# EAGLE design TDBR_MCP3221 (EAGLE 7.7.0)
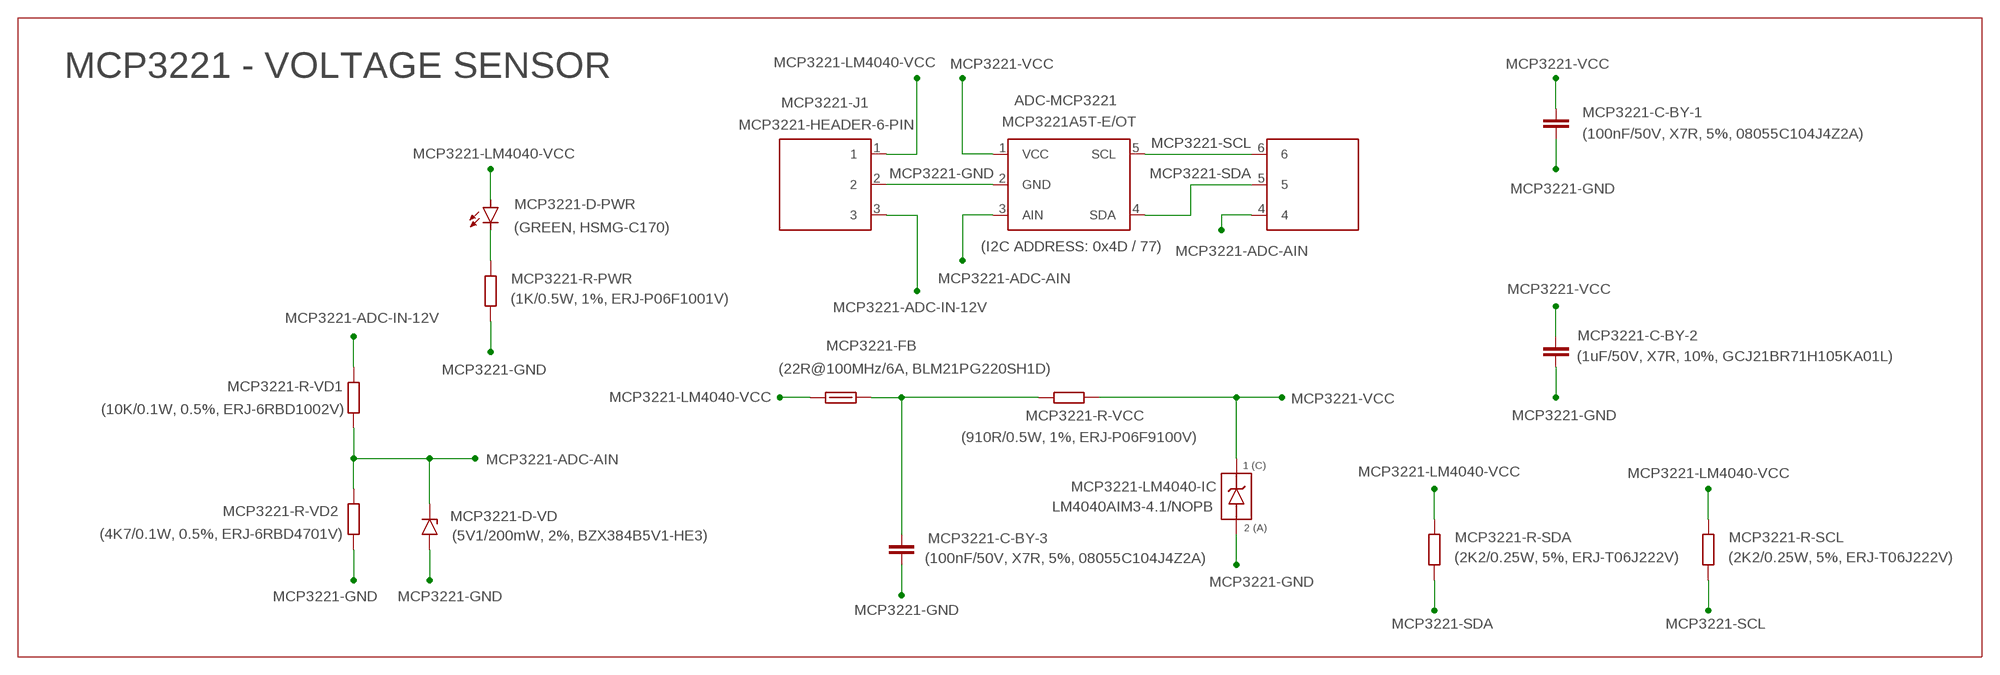
[diagram p0: schematic, sheet 1]

## Parts
ADC-MCP3221  MCP3221A5T-E/OT  [SOT-23-5]
MCP3221-C-BY-1  (100nF/50V, X7R, 5%, 08055C104J4Z2A)  08055C104J4Z2A  [0805]
MCP3221-C-BY-2  (1uF/50V, X7R, 10%, GCJ21BR71H105KA01L)  GCJ21BR71H105KA01L  [0805]
MCP3221-C-BY-3  (100nF/50V, X7R, 5%, 08055C104J4Z2A)  08055C104J4Z2A  [0805]
MCP3221-D-PWR  (GREEN, HSMG-C170)  HSMG-C170  [DIODE_0805]
MCP3221-D-VD  (5V1/200mW, 2%, BZX384B5V1-HE3)  BZX384B5V1-HE3  [SOD-323-DIODE]
MCP3221-FB  (22R@100MHz/6A, BLM21PG220SH1D)  BLM21PG220SH1D  [0805]
MCP3221-J1  MCP3221-HEADER-6-PIN  HEADER_6_PIN  [HEADER_2.54MM_6_PIN_VER]
MCP3221-LM4040-IC  LM4040AIM3-4.1/NOPB  [SOT-23-3]
MCP3221-R-PWR  (1K/0.5W, 1%, ERJ-P06F1001V)  ERJ-P06F1001V  [0805]
MCP3221-R-SCL  (2K2/0.25W, 5%, ERJ-T06J222V)  ERJ-T06J222V  [0805]
MCP3221-R-SDA  (2K2/0.25W, 5%, ERJ-T06J222V)  ERJ-T06J222V  [0805]
MCP3221-R-VCC  (910R/0.5W, 1%, ERJ-P06F9100V)  ERJ-P06F9100V  [0805]
MCP3221-R-VD1  (10K/0.1W, 0.5%, ERJ-6RBD1002V)  ERJ-6RBD1002V  [0805]
MCP3221-R-VD2  (4K7/0.1W, 0.5%, ERJ-6RBD4701V)  ERJ-6RBD4701V  [0805]

## Nets
MCP3221-ADC-AIN: ADC-MCP3221.3(AIN) MCP3221-D-VD.C MCP3221-J1.4 MCP3221-R-VD1.2 MCP3221-R-VD2.1
MCP3221-ADC-IN-12V: MCP3221-J1.3 MCP3221-R-VD1.1
MCP3221-GND: ADC-MCP3221.2(GND) MCP3221-C-BY-1.2(C) MCP3221-C-BY-2.1(A) MCP3221-C-BY-3.2(C) MCP3221-D-VD.A MCP3221-J1.2 MCP3221-LM4040-IC.2(A) MCP3221-LM4040-IC.3(A) MCP3221-R-PWR.1 MCP3221-R-VD2.2
MCP3221-LM4040-VCC: MCP3221-D-PWR.A MCP3221-FB.2 MCP3221-J1.1 MCP3221-R-SCL.2 MCP3221-R-SDA.2
MCP3221-LM4040_VCC_FILTERED: MCP3221-C-BY-3.1(A) MCP3221-FB.1 MCP3221-R-VCC.2
MCP3221-PWR: MCP3221-D-PWR.C MCP3221-R-PWR.2
MCP3221-SCL: ADC-MCP3221.5(SCL) MCP3221-J1.6 MCP3221-R-SCL.1
MCP3221-SDA: ADC-MCP3221.4(SDA) MCP3221-J1.5 MCP3221-R-SDA.1
MCP3221-VCC: ADC-MCP3221.1(VCC) MCP3221-C-BY-1.1(A) MCP3221-C-BY-2.2(C) MCP3221-LM4040-IC.1(C) MCP3221-R-VCC.1

## Notes on the sheet
- MCP3221 - VOLTAGE SENSOR
- (I2C ADDRESS: 0x4D / 77)

## Library data of the parts
ADC-MCP3221 = TDAR4:MCP3221: MICROCHIP SMD IC ADC, 1-CHANNEL, 12-BIT, I2C http://ww1.microchip.com/downloads/en/DeviceDoc/21732D.pdf 2C ADDRESSES: Part No. Package I2C Address Marking BIN HEX DEC MCP3221A0T-E/OT GE 1001000+R/W 0x48 72 MCP3221A1T-E/OT GE 1001001+R/W 0x49 73 MCP3221A2T-E/OT GE 1001010+R/W 0x4A 74 MCP3221A3T-E/OT GE 1001011+R/W 0x4B 75 MCP3221A4T-E/OT GE 1001100+R/W 0x4C 76 MCP3221A5T-E/OT GE 1001101+R/W 0x4D 77 MCP3221A6T-E/OT GE 1001110+R/W 0x4E 78 MCP3221A7T-E/OT GE 1001111+R/W 0x4F 79 MOUSER: 579-MCP3221A0T-E/OT (MCP3221A0T-E/OT) - 0x48 (72) 579-MCP3221A4T-E/OT (MCP3221A4T-E/OT) - 0x4C (76) 579-MCP3221A5T-E/OT (MCP3221A5T-E/OT) - 0x4D (77) 579-MCP3221A6T-E/OT (MCP3221A6T-E/OT) - 0x4E (78)
MCP3221-C-BY-1 MCP3221-C-BY-3 = TDAR4:08055C104J4Z2A: AVX SMD MLCC 0.1uF/50V, X7R, 5%, Flexible, Automotive
MCP3221-C-BY-2 = TDAR4:GCJ21BR71H105KA01L: MURATA SMD MLCC 1uF/50V, X7R, 10%, Flexible, Automotive
MCP3221-D-PWR = TDAR4:HSMG-C170: BROADCOM SMD DIODE LED (GREEN), 15mcd, 20mA, 2.2Vf, 170°, Diffused, Standard
MCP3221-D-VD = TDAR4:BZX384: VISHAY DIODE ZENER 5V1/5V6, 200mW, 2%, AEC-Q101, Automotive http://www.vishay.com/docs/85764/bzx384.pdf 5V1 MOUSER: BZX384B5V1-HE3-08 / BZX384B5V1-HE3-18 (78-BZX384B5V1-HE3-08 / 78-BZX384B5V1-HE3-18) 5V6 MOUSER: BZX384B5V6-HE3-08 / BZX384B5V6-HE3-18 (78-BZX384B5V6-HE3-08 / 78-BZX384B5V6-HE3-18)
MCP3221-FB = TDAR4:BLM21PG220SH1D: MURATA FERRITE BEAD 22R @ 100MHz, 6A, EMI Filter Powerlines, AEC-Q200, Automotive
MCP3221-J1 = TDAR4:HEADER_6_PIN
MCP3221-LM4040-IC = TDAR4:LM4040: TI SMD IC VOLTAGE REFERENCE SHUNT 2.048V/4.096V, 15mA, 0.1%, AEC-Q100, Automotive LM4040AIM3-2.0/NOPB 2.048V LM4040AIM3-4.1/NOPB 4.096V
MCP3221-R-PWR = TDAR4:ERJ-P06F1001V: PANASONIC SMD RESISTOR THICK FILM 1K/0.5W, 1%, 100ppm, AEC-Q200, Automotive
MCP3221-R-SCL MCP3221-R-SDA = TDAR4:ERJ-T06J222V: PANASONIC SMD RESISTOR THICK FILM 2K2/0.25W, 5%, 200ppm, AEC-Q200, Automotive
MCP3221-R-VCC = TDAR4:ERJ-P06F9100V: PANASONIC SMD RESISTOR THICK FILM 910R/0.5W, 1%, 100ppm, AEC-Q200, Automotive
MCP3221-R-VD1 = TDAR4:ERJ-6RBD1002V: PANASONIC SMD RESISTOR 10K/100mW, 0.5%, 50ppm, AEC-Q200, Automotive
MCP3221-R-VD2 = TDAR4:ERJ-6RBD4701V: PANASONIC SMD RESISTOR 4K7/100mW, 0.5%, 50ppm, AEC-Q200, Automotive

## Net classes
0 default: clearance 0.355 mm

## Board
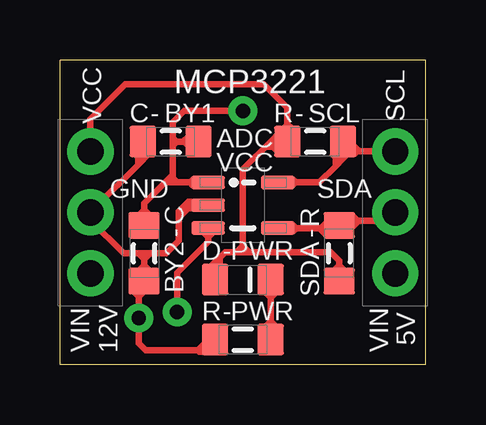
[diagram p1: board, top side]
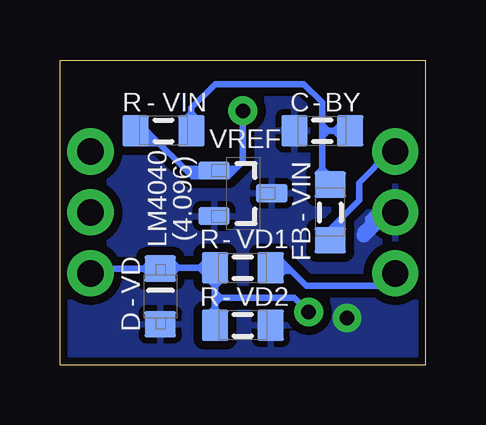
[diagram p2: board, bottom side, seen from below]

Size 15.24 x 12.7 mm. Coordinates in mm from the lower left corner, seen from the top.
Outline: 15.24,0 15.24,12.7 0,12.7 0,0 15.24,0
Copper layers (1*16): Top 0.035mm / dielectric 1.5mm / Bottom 0.035mm
Design rules "ITEADstudio_DRC *": minimum track width 10mil, minimum drill 12mil, track to track 10mil, track to pad 10mil, pad to pad 10mil, via to via 10mil, smd to smd 0mil, copper to edge 12mil, drill to drill 12mil, minimum pad ring 10mil, minimum via ring 6mil, stop-mask expansion 2mil, vias tented up to drill 100mil, thermal gap 10mil

### Footprints (pad centres in the part's own frame; a part is rotated, then mirrored left to right if it is on the bottom)
SOT-23-5 = smd 1.4 x 0.55: 1 -1.45,0.95; 2 -1.45,0; 3 -1.45,-0.95; 4 1.45,-0.95; 5 1.45,0.95
0805 = smd 1.1 x 1.3: 1 -1.16,0; 2 1.16,0
DIODE_0805 = smd 1.1 x 1.3: A 1.16,0; C -1.16,0
SOD-323-DIODE = smd 1.1 x 1.3: A 1.16,0; C -1.16,0
HEADER_2.54MM_6_PIN_VER = drill 1.1 pad 1.925: 1 -6.35,2.54; 2 -6.35,0; 3 -6.35,-2.54; 4 6.35,-2.54; 5 6.35,0; 6 6.35,2.54
SOT-23-3 = smd 0.75 x 1.3: 1 -0.95,-1.2; 2 0.95,-1.2; 3 0,1.2

### Placement (x,y rotation side)
ADC-MCP3221  7.62,6.65 0 top
MCP3221-C-BY-1  4.61,9.3 180 top
MCP3221-C-BY-2  3.5,4.65 90 top
MCP3221-C-BY-3  4.31,9.75 180 bottom
MCP3221-D-PWR  7.62,3.55 180 top
MCP3221-D-VD  11.06,2.85 270 bottom
MCP3221-FB  3.98,6.35 270 bottom
MCP3221-J1  7.62,6.35 0 top
MCP3221-LM4040-IC  7.62,7.15 270 bottom
MCP3221-R-PWR  7.62,1.05 0 top
MCP3221-R-SCL  10.63,9.3 180 top
MCP3221-R-SDA  11.63,4.65 270 top
MCP3221-R-VCC  10.93,9.75 0 bottom
MCP3221-R-VD1  7.62,4.04 180 bottom
MCP3221-R-VD2  7.62,1.65 0 bottom

### Tracks (layer width: path | path; a pad name or v marks a point on that pad's centre or on a via)
MCP3221-ADC-AIN  (via drill 0.6 pad 1.2)
  Top 0.279: v4.88,2.2 4.88,3.84 6.17,5.13 ADC-MCP3221.3 6.17,5.32 | 6.17,5.32 6.42,5.57 5.92,5.57 6.17,5.32
  Bottom 0.279: 8.78,2.8 MCP3221-R-VD2.1 8.78,2.31 | 8.78,2.8 8.78,3.42 | 8.78,3.42 MCP3221-R-VD1.2 | v4.88,2.2 5.48,2.8 8.78,2.8 | MCP3221-R-VD1.2 8.78,4.01 | 11,4.04 11.26,4.04 | 11,4.04 MCP3221-R-VD1.2 | 9.03,3.53 8.78,3.28 | 8.78,3.28 8.53,3.53 9.03,3.53 | 9.19,3.79 9.44,4.04 9.19,4.29 9.19,3.79 | 9.19,3.79 8.94,4.04 MCP3221-R-VD1.2 | 9.03,3.53 8.78,3.77 MCP3221-R-VD1.2 | 8.78,2.31 8.53,2.06 9.03,2.06 8.78,2.31 | 8.78,3.04 8.53,2.79 8.78,2.54 8.78,3.04 | 8.78,3.28 8.78,3.27 8.78,3.04 | 11,4.04 11.03,4.01 MCP3221-D-VD.C 11.76,4.01 | MCP3221-J1.4 13.77,4.01 11.76,4.01 | 8.42,1.89 8.42,1.99 8.72,2.29 8.85,2.29 9.01,2.14 9.01,2.15 8.79,2.37 8.79,3.41 8.78,3.42 | 10.64,4.37 10.31,4.04 | 10.31,4.04 10.23,4.04 | 10.31,4.04 10.33,4.04 10.54,3.82 11.57,3.82 11.76,4.01 | 11.76,4.01 11.51,4.26 11.22,4.26
MCP3221-ADC-IN-12V
  Bottom 0.279: MCP3221-J1.3 1.78,3.3 4.98,3.3 5.72,4.04 5.77,4.04 | 5.77,4.04 MCP3221-R-VD1.1 | 6.21,3.69 6.12,3.69 5.88,3.93 | 5.88,3.93 5.61,3.93 | 5.61,3.93 5.47,3.79 | 5.61,3.93 6.1,4.42 6.54,4.42 | 5.77,4.04 5.88,3.93
MCP3221-GND  (via drill 0.6 pad 1.2)
  Top 0.279: 4.96,6.4 4.96,5.17 4.43,4.65 3.5,4.65 | 5.86,0.6 3.58,0.6 3.28,0.9 v3.28,1.95 3.28,3.49 MCP3221-C-BY-2.1 | 5.86,0.6 6.46,0.6 MCP3221-R-PWR.1 | 4.96,6.4 5.21,6.65 ADC-MCP3221.2 | MCP3221-C-BY-2.1 3.5,4.15 | 3.5,4.15 3.5,4.4 | 3.5,4.4 3.5,4.65 | 5.84,6.63 5.68,6.78 5.33,6.78 4.95,6.4 | 4.95,6.4 4.95,6.13 5.33,6.52 5.59,6.52 | 4.96,6.4 4.95,6.4 | 3.5,4.15 3.25,3.9 3.75,3.9 3.5,4.15 | 3.5,4.4 3.26,4.65 3.76,4.65 3.51,4.4 3.5,4.4 | 3.5,4.15 | 3.54,3.08 3.29,2.83 3.04,3.08 3.54,3.08 | 6.2,1.06 5.74,0.6 | 5.74,0.6 5.5,0.6 | 5.74,0.6 5.8,0.54 5.86,0.6 | 3.54,3.08 3.5,3.11 MCP3221-C-BY-2.1 | 5.86,0.6 | 6.37,0.67 6.23,0.54 5.8,0.54 5.86,0.6 | 5.86,0.6 6.07,0.8 6.09,0.8 | 3.45,8.54 MCP3221-C-BY-1.2 | 3.5,4.65 2.65,4.65 1.27,6.03 MCP3221-J1.2 3.45,8.53 3.45,8.54 | 3.12,8.79 3.15,8.79 3.27,8.67 | 3.27,8.67 3.27,8.34 3.17,8.25 3.71,8.79 | 3.32,8.66 3.58,8.66 3.43,8.51 3.28,8.66 | 3.32,8.66 3.28,8.66 | 3.28,8.66 3.27,8.66 3.27,8.67 | 3.45,8.54 3.32,8.66
  Bottom 0.279: v3.28,1.95 3.28,2.2 | 2.7,5.6 2.4,5.9 2.4,6.1 2.2,6.3 2.1,6.3
  Bottom 0.61: 2.58,5.4 1.68,6.3 1.3,6.3
  pour Bottom (isolate 0.279): 0.16,12.54 15.08,12.54 15.08,0.16 0.16,0.16
MCP3221-LM4040-VCC
  Top 0.279: 7.62,4.7 6.88,4.7 6.46,4.28 | 7.62,4.7 11.28,4.7 11.63,4.34 MCP3221-R-SDA.2 11.63,4.14 | MCP3221-D-PWR.A 6.46,4.28 | MCP3221-J1.1 1.27,10.24 2.73,11.7 8.48,11.7 9.47,10.71 MCP3221-R-SCL.2 8.98,9.3 | 7.62,4.7 7.62,8.14 8.78,9.3 | 6.12,3.82 6.12,3.94 6.64,4.46 6.65,4.46 6.65,3.89 6.62,3.86 6.62,4.12 6.46,4.28 | 7.62,4.7 7.87,4.7 7.62,4.95 7.37,4.7 7.62,4.7 | 11.63,4.14 11.88,3.9 11.38,3.9 11.63,4.15 11.63,4.14 | 7.62,4.7 | 8.78,9.3 8.98,9.3 | 8.78,9.3 9.16,9.68 9.16,9.71 9.19,9.71 9.33,9.85 | 9.17,8.85 9.17,8.87 8.95,9.09 | 8.95,9.09 8.57,9.09 8.55,9.07 | 8.8,9.13 8.81,9.13 8.88,9.07 | 8.88,9.07 9.06,8.89 | 8.91,9.23 8.91,9.42 8.76,9.27 8.91,9.12 | 9.33,9.85 9.63,9.85 9.48,10 9.33,9.85 | 8.91,9.12 8.92,9.12 8.95,9.09 | 8.91,9.12 8.91,9.23 | 8.91,9.23 8.98,9.3 | 8.91,9.12 8.91,9.11 8.88,9.07
  Bottom 0.279: MCP3221-FB.2 3.68,5.19 3.68,5.95 2.78,6.85 2.78,7.58 1.47,8.89 MCP3221-J1.1 | 3.53,5.3 3.49,5.35 3.49,6.14 4.11,5.52 4.11,5.28 4.07,5.28 MCP3221-FB.2 | 3.69,5.51 3.56,5.51 | 3.56,5.51 3.47,5.6 | 3.56,5.51 3.88,5.19 MCP3221-FB.2
MCP3221-LM4040_VCC_FILTERED
  Bottom 0.279: 4.31,9.75 4.31,7.71 3.98,7.71 MCP3221-FB.1 | 4.31,9.75 4.31,10.93 5.08,11.7 8.78,11.7 9.77,10.71 9.77,10.51 | 9.77,10.51 MCP3221-R-VCC.2 | MCP3221-C-BY-3.1 3.81,9.75 | 3.81,9.75 4.06,9.75 | 9.77,10.51 9.52,10.26 10.02,10.26 9.77,10.51 | 4.49,7.78 4.49,8 4.31,8.17 4.03,7.89 4.03,7.81 3.98,7.76 MCP3221-FB.1 | 4.06,9.75 4.31,9.5 4.31,10 4.06,9.75 | 3.81,9.75 3.56,10 3.56,9.5 3.81,9.75 | 4.06,9.75 4.31,9.75 | 4.08,7.79 4.08,7.88 | 4.08,7.88 4.06,7.9 | 4.08,7.88 3.98,7.79 MCP3221-FB.1
MCP3221-PWR
  Top 0.279: 9.03,1.56 8.78,1.81 8.53,1.56 9.03,1.56 | 8.53,3.04 8.78,2.79 9.03,3.04 8.53,3.04 | 9.03,1.56 8.78,1.31 MCP3221-R-PWR.2 MCP3221-D-PWR.C 8.78,3.29 8.53,3.04
MCP3221-SCL
  Top 0.279: ADC-MCP3221.5 9.81,7.6 | 9.81,7.6 10.8,7.6 11.48,8.28 | 11.48,8.28 11.79,8.59 11.79,8.66 | 11.79,8.66 MCP3221-R-SCL.1 12.2,8.89 12.28,8.89 | MCP3221-J1.6 12.28,8.89 | 11.99,9 11.99,8.79 11.76,8.56 | 11.76,8.56 11.65,8.45 | 11.59,8.39 11.65,8.45 | 11.65,8.45 11.65,8.58 11.42,8.81 11.42,8.93 | 11.74,8.71 11.91,8.71 11.76,8.56 | 11.74,8.71 11.61,8.71 11.76,8.56 | 12.28,8.89 12.28,9.09 12.43,8.94 12.28,8.79 12.28,8.89 | 11.79,8.66 11.74,8.71 | 11.76,8.56 | 12.28,8.89 | 9.3,7.58 9.42,7.46 9.68,7.46 9.81,7.6 | 9.81,7.6 9.68,7.74 9.49,7.74 | 11.38,9.01 11.38,8.73 11.48,8.63 11.48,8.28
MCP3221-SDA
  Top 0.279: 11.53,5.7 MCP3221-R-SDA.1 | MCP3221-J1.5 13.62,6 11.62,6 MCP3221-R-SDA.1 | 12.17,5.72 12.42,5.97 12.17,6.22 12.17,5.72 | 11.13,5.95 10.88,5.7 11.13,5.45 11.13,5.78 | 11.13,5.78 11.13,5.95 | 11.53,5.7 11.44,5.78 11.13,5.78 | MCP3221-R-SDA.1 11.72,5.72 12.17,5.72 | 9.12,5.72 9.1,5.72 ADC-MCP3221.4 9.83,5.7 | 11.47,5.45 11.42,5.4 11.08,5.4 10.83,5.65 10.83,5.66 11.12,5.95 11.13,5.95 | 11.53,5.7 9.83,5.7 | 9.13,5.65 9.22,5.56 9.7,5.56 9.83,5.7 | 9.83,5.7 9.7,5.83 9.45,5.83
MCP3221-VCC  (via drill 0.6 pad 1.2)
  Top 0.279: 3.5,6.46 3.75,6.21 3.25,6.21 3.5,6.46 | 3.5,6.46 MCP3221-C-BY-2.2 3.5,6.72 4.38,7.6 4.7,7.6 | 4.8,7.6 ADC-MCP3221.1 6.11,7.66 5.99,7.66 5.92,7.74 5.55,7.74 5.42,7.6 5.56,7.46 5.67,7.46 | 4.8,7.6 4.7,7.6 | 4.7,7.6 4.7,7.73 | 4.7,7.73 4.7,9.3 | v7.62,10.58 5.18,10.58 4.7,10.1 4.7,9.3 | MCP3221-C-BY-1.1 4.79,9.3 | 4.79,9.3 4.7,9.3 | 4.87,9.29 4.72,9.14 4.72,9.44 4.87,9.29 | 5.17,9.31 5.32,9.46 5.32,9.16 5.17,9.31 | 4.87,9.29 4.8,9.29 4.79,9.3 | 4.87,9.29 5.15,9.29 5.17,9.31 | 4.84,7.65 4.54,7.65 4.69,7.8 4.84,7.65 | 4.84,7.65 4.8,7.6 | 4.7,7.92 4.7,7.66 4.69,7.64 4.69,7.71 4.7,7.73 | 4.7,8.1 4.7,7.92 | 4.7,7.92 4.24,7.46
  Bottom 0.279: v7.62,10.58 7.62,8.46 7.98,8.1 | 9.98,8.1 MCP3221-LM4040-IC.1 7.98,8.1 | 9.98,8.1 11.33,9.45 | 11.33,9.45 11.43,9.45 | 11.43,9.45 12.09,9.45 MCP3221-R-VCC.1 | 11.43,9.45 11.68,9.7 11.68,9.24 11.12,9.24 | 11.12,9.24 11.06,9.18 | 11.12,9.24 11.49,9.61 11.91,9.61 11.6,9.31 11.25,9.31 | 8.48,8.04 8.31,7.86 8.22,7.86 7.98,8.1 | 7.98,8.1 7.92,8.17 8.43,8.17 8.44,8.17 | 9.01,7.95 9.1,7.86 9.74,7.86 10.05,8.16 9.97,8.16 | 9.97,8.16 9.29,8.16 9.21,8.09 | 7.98,8.1 | 9.98,8.1 9.97,8.1 9.97,8.16 | 12,10.15 12,10.11 11.77,9.88 | 11.77,9.88 11.33,9.43 | 11.33,9.45 11.76,9.88 11.77,9.88

### Text on the board
tNames: MCP3221 | VCC | SCL | C | - | BY1 | R | - | SCL | ADC | VCC | GND | SDA | - | C | R | D | - | PWR | - | BY2 | SDA | 12V | R | - | PWR | 5V | VIN | VIN
bNames: BY | - | C | VIN | - | R | VREF | VIN | (4.096) | LM4040 | - | FB | VD1 | - | R | VD | VD2 | - | R | - | D